# Altium schematic sheet SD.SchDoc
size A4
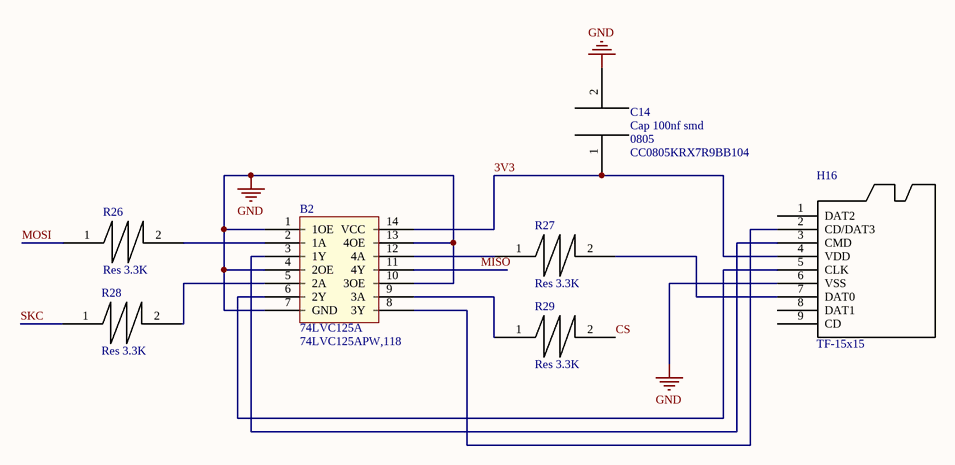
[diagram p0: SD.SchDoc]

## Parts
B2  74LVC125A  [74LVC125APW,118]
C14  Cap 100nf smd  Package: 0805  MFR.Part #: CC0805KRX7R9BB104  [CAP100NFSMD]
H16  TF-15x15  [TF-15x15]
R26  Res 3.3K  [Res 3.3K]
R27  Res 3.3K  [Res 3.3K]
R28  Res 3.3K  [Res 3.3K]
R29  Res 3.3K  [Res 3.3K]

## Nets
GND: B2.1(1OE) B2.4(2OE) B2.7(GND) B2.10(3OE) B2.13(4OE) C14.2 H16.6(VSS)
3V3: B2.14(VCC) C14.1 H16.4(VDD)
CS: R29.2
MISO: B2.11(4Y)
MOSI: R26.1
SKC: R28.1
NetB2_2: B2.2(1A) R26.2
NetB2_3: B2.3(1Y) H16.3(CMD)
NetB2_5: B2.5(2A) R28.2
NetB2_6: B2.6(2Y) H16.5(CLK)
NetB2_8: B2.8(3Y) H16.2(CD/DAT3)
NetB2_9: B2.9(3A) R29.1
NetB2_12: B2.12(4A) R27.1
NetH16_7: H16.7(DAT0) R27.2

Not connected (* = marked no-connect by the designer): H16 1(DAT2) 8(DAT1) 9(CD)

## Library data of the parts
C14 = Cap 100nf smd: 100nf
R26-R29 = Res 3.3K: AECR0805F3K30K9; MFR.Part #: AECR0805F3K30K9; Package: 0805
B2 = 74LVC125A: Package: TSSOP-14_4.4x5.0x0.65P; MFR.Part #: 74LVC125APW,118
H16 = TF-15x15: MFR.Part #: TF-15x15; Package: 14.5x14.75x1.85mm